# Altium schematic sheet sync.SchDoc
size A4
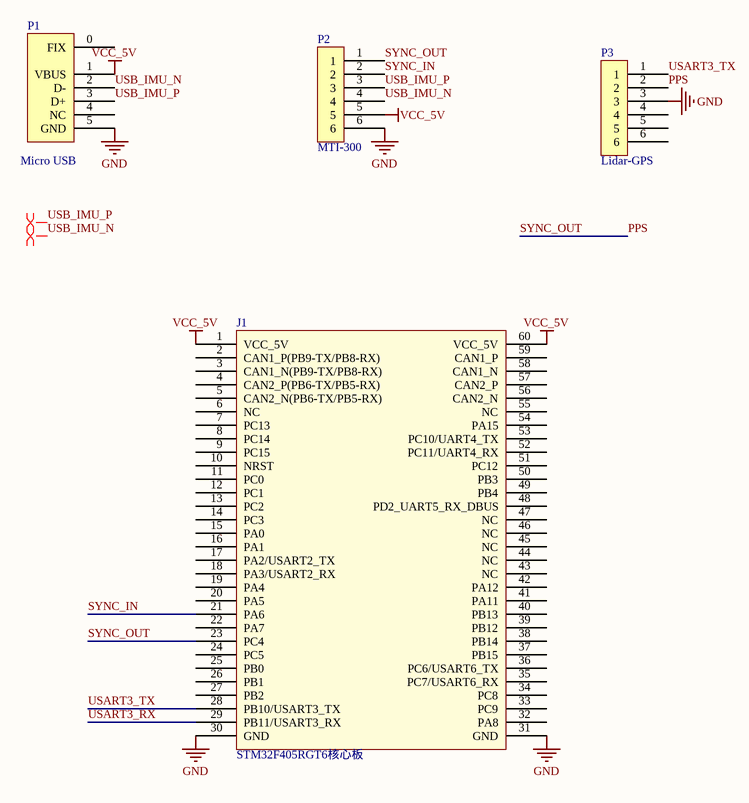
[diagram p0: sync.SchDoc]

## Parts
J1  STM32F405RGT6核心板  [3710F060037G0FR01]
P1  Micro USB  [Micro USB]
P2  MTI-300  [KF128-3.81-6P]
P3  Lidar-GPS  [FPC1.0-2H-WS-6P]

## Nets
GND: J1.30(GND) J1.31(GND) P1.5(GND) P2.6 P3.3
VCC_5V: J1.1(VCC_5V) J1.60(VCC_5V) P1.1(VBUS) P2.5
PPS: J1.23(PC4) P2.1 P3.2  [also labelled SYNC_OUT]
SYNC_IN: J1.21(PA6) P2.2
USART3_RX: J1.29(PB11/USART3_RX)
USART3_TX: J1.28(PB10/USART3_TX) P3.1
USB_IMU_N: P1.2(D-) P2.4
USB_IMU_P: P1.3(D+) P2.3

Not connected (* = marked no-connect by the designer): J1 2(CAN1_P(PB9-TX/PB8-RX)) 3(CAN1_N(PB9-TX/PB8-RX)) 4(CAN2_P(PB6-TX/PB5-RX)) 5(CAN2_N(PB6-TX/PB5-RX)) 6(NC) 7(PC13) 8(PC14) 9(PC15) 10(NRST) 11(PC0) 12(PC1) 13(PC2) 14(PC3) 15(PA0) 16(PA1) 17(PA2/USART2_TX) 18(PA3/USART2_RX) 19(PA4) 20(PA5) 22(PA7) 24(PC5) 25(PB0) 26(PB1) 27(PB2) 32(PA8) 33(PC9) 34(PC8) 35(PC7/USART6_RX) 36(PC6/USART6_TX) 37(PB15) 38(PB14) 39(PB12) 40(PB13) 41(PA11) 42(PA12) 43(NC) 44(NC) 45(NC) 46(NC) 47(NC) 48(PD2_UART5_RX_DBUS) 49(PB4) 50(PB3) 51(PC12) 52(PC11/UART4_RX) 53(PC10/UART4_TX) 54(PA15) 55(NC) 56(CAN2_N) 57(CAN2_P) 58(CAN1_N) 59(CAN1_P); P1 0(FIX) 4(NC); P3 4 5 6

## Layout directives
differential pair: (no net found under the mark)

## Notes on the sheet
- Labels drawn without touching a wire or pin: USB_IMU_N, USB_IMU_P

## Library data of the parts
J1 = STM32F405RGT6核心板: 3710(F/M)060037G0FR01
P1 = Micro USB: Micro USB底座
P2 = KF-6P
P3 = SH1.0-6P